# EAGLE design MainController (EAGLE 6.5.0)
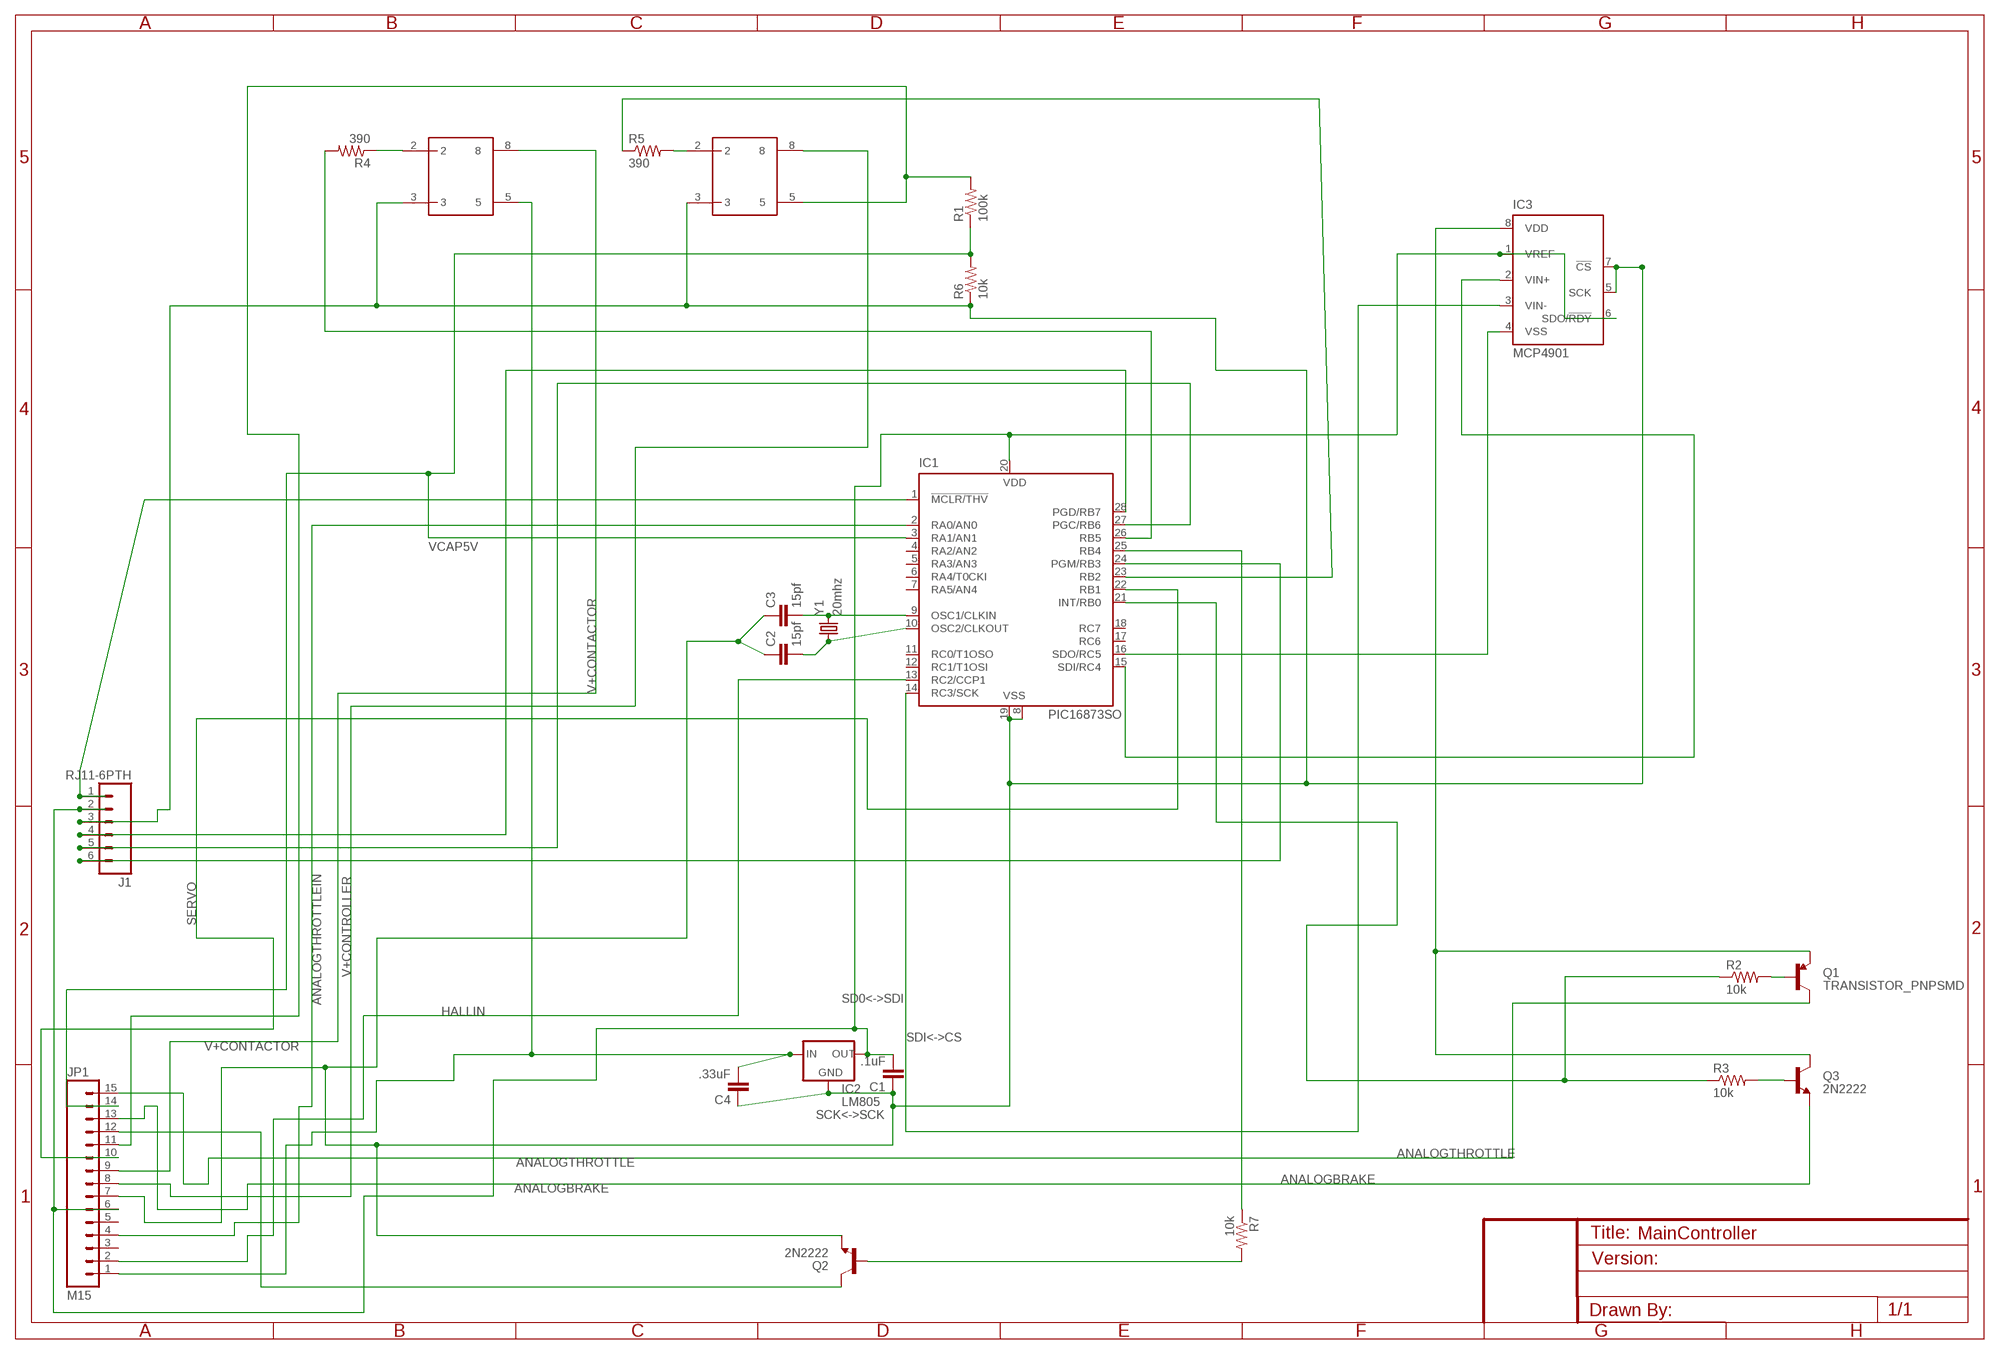
[diagram p0: schematic, sheet 1]

## Parts
C1  .1uF  CAP0402-CAP  [0402-CAP]
C2  15pf  CAP0402-CAP  [0402-CAP]
C3  15pf  CAP0402-CAP  [0402-CAP]
C4  .33uF  CAP0402-CAP  [0402-CAP]
IC1  PIC16873SO  [SO28W]
IC2  LM805  78XXL  [78XXL]
IC3  MCP4901  MCP3553SN  [SO-08]
J1  RJ11-6PTH  [RJ11-6]
JP1  M15  [1X15]
Q1  TRANSISTOR_PNPSMD  [SOT23-3]
Q2  2N2222  TRANSISTOR_NPNSOT23-3  [SOT23-3]
Q3  2N2222  TRANSISTOR_NPNSOT23  [SOT23]
R1  100k  RESISTOR0805-RES  [0805]
R2  10k  RESISTOR0805-RES  [0805]
R3  10k  RESISTOR0805-RES  [0805]
R4  390  RESISTOR0805-RES  [0805]
R5  390  RESISTOR0805-RES  [0805]
R6  10k  RESISTOR0805-RES  [0805]
R7  10k  RESISTOR0805-RES  [0805]
U$14  OPTO_DARL_6N138S  [8-SMD]
U$18  OPTO_DARL_6N138S  [8-SMD]
Y1  20mhz  CRYSTALHC49US  [HC49US]

## Nets
ANALOGBRAKE: JP1.13 Q3.2(E)
ANALOGTHROTTLE: JP1.15 Q1.3(C)
ANALOGTHROTTLEIN: IC1.2(RA0/AN0) JP1.4
GROUND: C1.1 C2.1 C3.1 C4.1 IC1.8(VSS) IC1.19(VSS) IC2.GND IC3.5(SCK) IC3.7(!CS) J1.3 JP1.7 Q2.2(E) R6.1 U$14.3 U$18.3
HALLIN: IC1.13(RC2/CCP1) JP1.2
N$1: R4.1 U$14.2
N$2: IC1.1(!MCLR/THV) J1.1
N$3: IC1.28(PGD/RB7) J1.4
N$4: IC1.27(PGC/RB6) J1.5
N$5: C3.2 IC1.9(OSC1/CLKIN) Y1.2
N$6: C2.2 IC1.10(OSC2/CLKOUT) Y1.1
N$7: IC3.8(VDD) Q1.2(E) Q3.3(C)
N$8: IC1.26(RB5) R4.2
N$9: IC1.23(RB2) R5.1
N$10: R5.2 U$18.2
N$11: Q3.1(B) R3.2
N$12: JP1.12 Q2.3(C)
N$13: Q2.1(B) R7.2
N$14: IC1.21(INT/RB0) R2.1 R3.1
N$15: IC1.25(RB4) R7.1
N$16: Q1.1(B) R2.2
N$17: IC1.24(PGM/RB3) J1.6
N$19: JP1.11 R1.2 U$18.5
N$20: C4.2 IC2.IN JP1.1 U$14.5
N$25: C1.2 IC1.20(VDD) IC2.OUT IC3.1(VREF) IC3.6(SDO/!RDY) J1.2 JP1.6
SCK<->SCK: IC1.14(RC3/SCK) IC3.3(VIN-)
SD0<->SDI: IC1.16(SDO/RC5) IC3.4(VSS)
SDI<->CS: IC1.15(SDI/RC4) IC3.2(VIN+)
SERVO: IC1.22(RB1) JP1.10
V+CONTACTOR: JP1.9 U$14.8
V+CONTROLLER: JP1.8 U$18.8
VCAP5V: IC1.3(RA1/AN1) JP1.14 R1.1 R6.2
Unconnected: IC1.4(RA2/AN2) IC1.5(RA3/AN3) IC1.6(RA4/T0CKI) IC1.7(RA5/AN4) IC1.11(RC0/T1OSO) IC1.12(RC1/T1OSI) IC1.17(RC6) IC1.18(RC7) JP1.3 JP1.5

## Library data of the parts
C1-C4 = SparkFun:CAP: Capacitor Standard 0603 ceramic capacitor, and 0.1" leaded capacitor.
IC1 = microchip:PIC16*873: MICROCONTROLLER flash type; OC_FARNELL: unknown; OC_NEWARK: unknown
IC2 = v-reg:78XXL: VOLTAGE REGULATOR
IC3 = microchip:MCP355*: Low-Power, Single-Channel 22-Bit Delta-Sigma ADCs Source: http://ww1.microchip.com/downloads/en/DeviceDoc/21950c.pdf; MF: MICROCHIP; MPN: MCP3553-E/SN; OC_FARNELL: 1605569; OC_NEWARK: 56K7004
J1 = SparkFun:RJ11-6: RJ11 Jack Simple 6 pin RJ11 jack. Commonly found on CAT3 devices and Microchip programmers. SKU: PRT-00132
JP1 = SparkFun:M15: Header 15 Standard 15-pin 0.1" header. Use with straight break away headers (SKU : PRT-00116), right angle break away headers (PRT-00553), swiss pins (PRT-00743), machine pins (PRT-00117), and female headers (PRT-00115).
Q1 = SparkFun:TRANSISTOR_PNP
Q2 Q3 = SparkFun:TRANSISTOR_NPN: Transistor NPN BJT configuration in SOT23 package. MMBT2222 is the common NPN we use. Double check BCE configuration again layout.
R1-R7 = SparkFun:RESISTOR: Resistor Basic schematic elements and footprints for 0603, 1206, and PTH resistors.
U$14 U$18 = SparkFun-DiscreteSemi-2:OPTO_DARL_6N138S: Optoisolator, darlington pair output
Y1 = SparkFun:CRYSTAL: Crystals Various standard crystals. Proven footprints. Spark Fun Electronics SKU : COM-00534

## Board
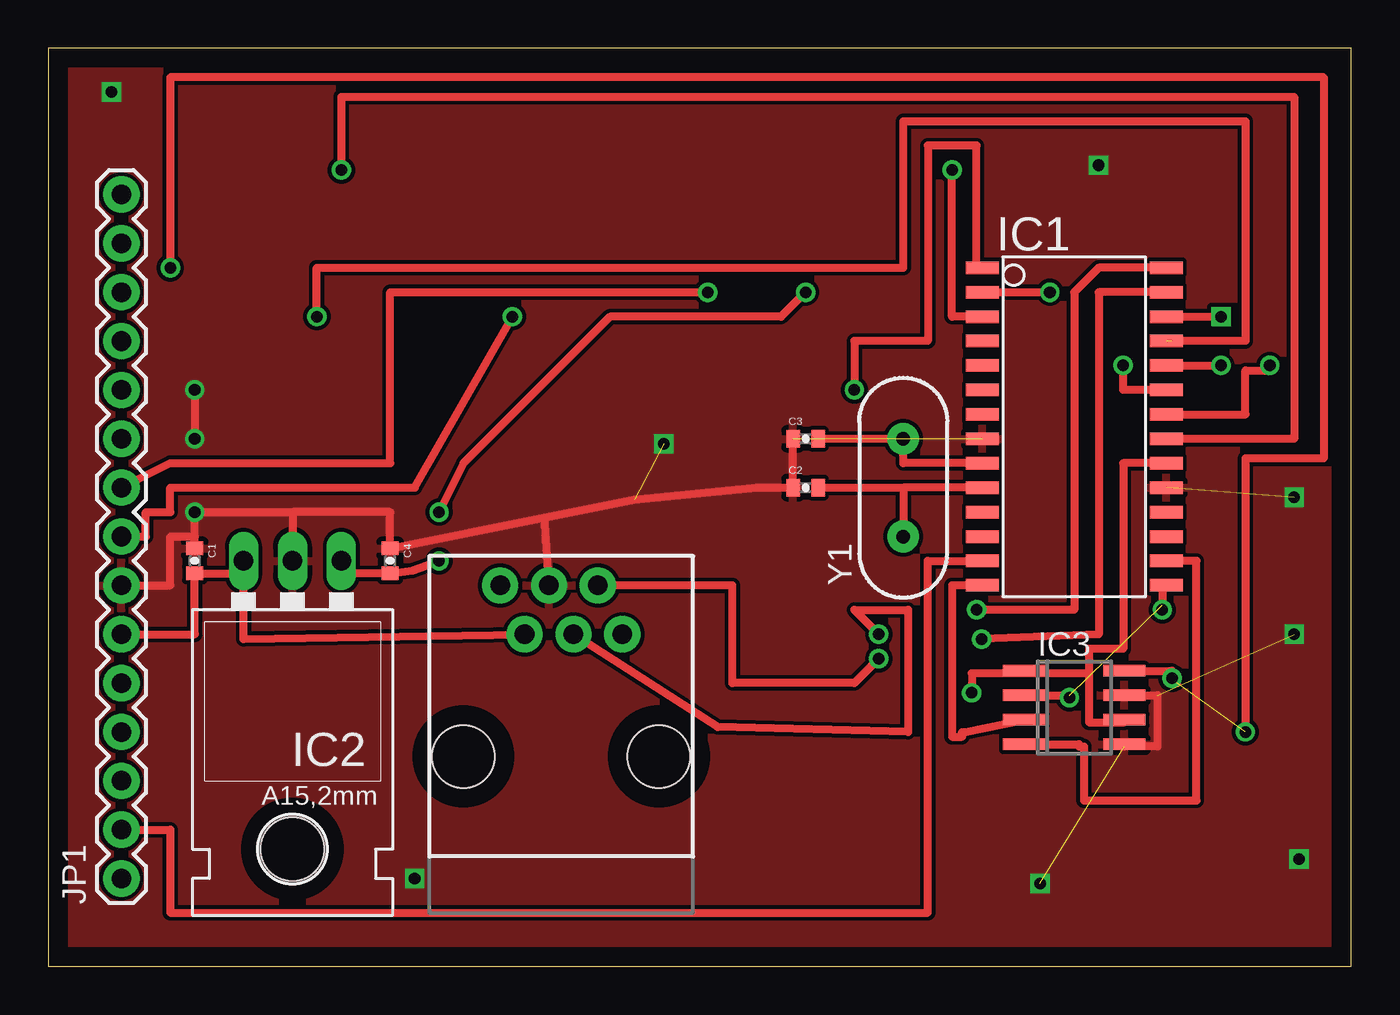
[diagram p1: board, top side]
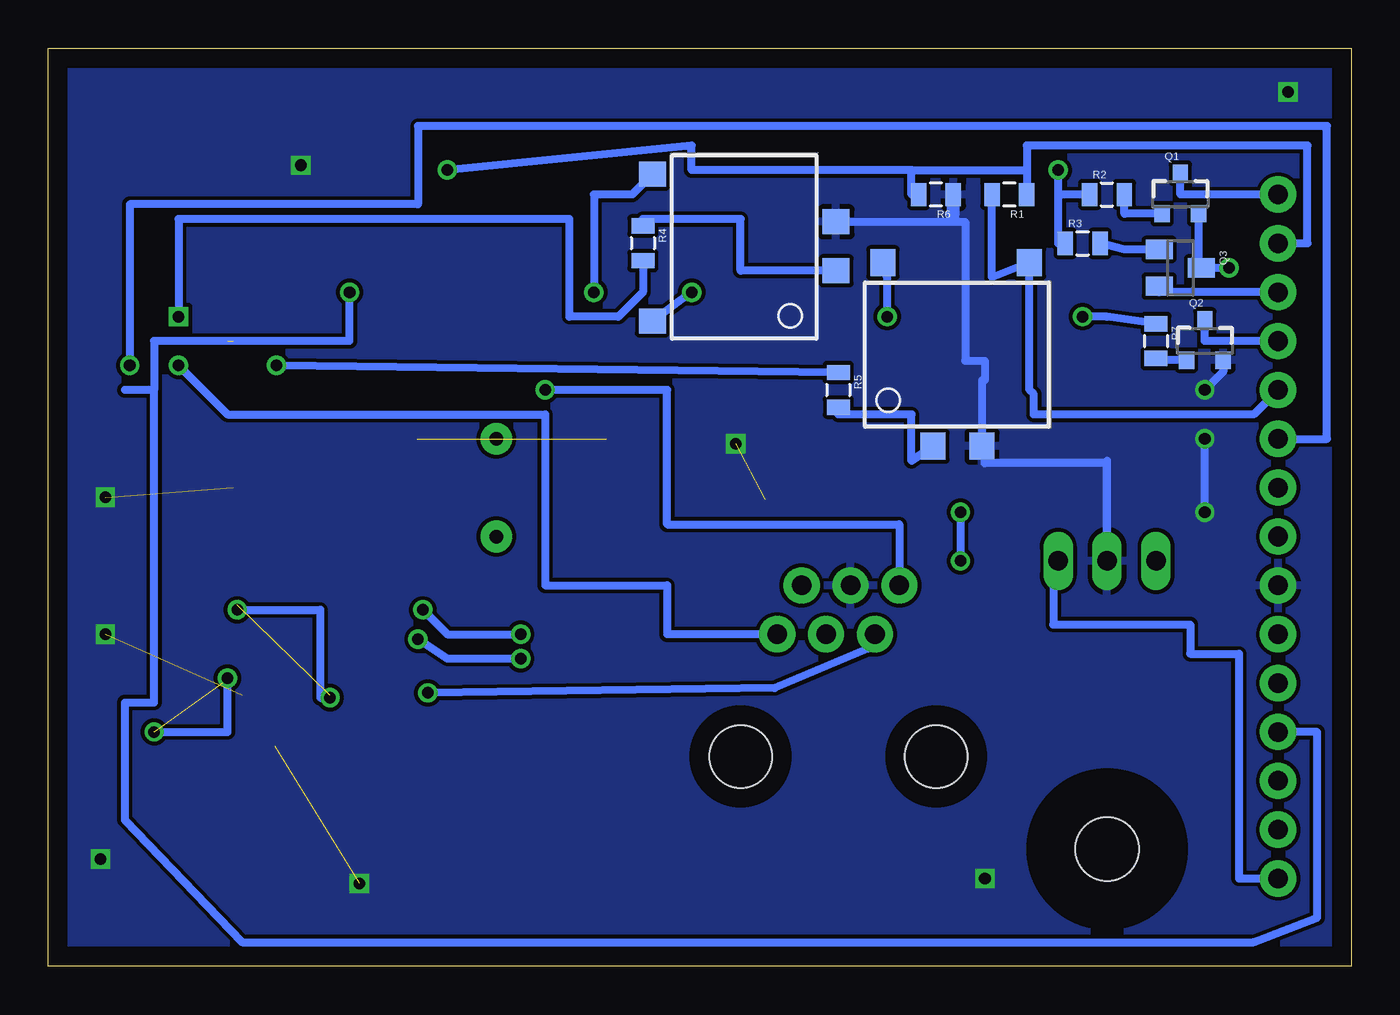
[diagram p2: board, bottom side, seen from below]

Size 67.74 x 47.74 mm. Coordinates in mm from the lower left corner, seen from the top.
Outline: 0,0 67.74,0 67.74,47.74 0,47.74 0,0
Copper layers (1*16): Top 0.035mm / dielectric 1.5mm / Bottom 0.035mm
Design rules "default": minimum track width 5mil, minimum drill 10mil, track to track 8mil, track to pad 8mil, pad to pad 8mil, via to via 8mil, smd to smd 8mil, copper to edge 40mil, drill to drill 8mil, minimum pad ring 10mil, minimum via ring 8mil, stop-mask expansion 4mil, vias tented up to drill 0mil, thermal gap 10mil

### Footprints (pad centres in the part's own frame; a part is rotated, then mirrored left to right if it is on the bottom)
0402-CAP = smd 0.7 x 0.9: 1 -0.65,0; 2 0.65,0
SO28W = smd 0.65 x 1.7: 1 -7.62,-4.78; 2 -6.35,-4.78; 3 -5.08,-4.78; 4 -3.81,-4.78; 5 -2.54,-4.78; 6 -1.27,-4.78; 7 0,-4.78; 8 1.27,-4.78; 9 2.54,-4.78; 10 3.81,-4.78; 11 5.08,-4.78; 12 6.35,-4.78; 13 7.62,-4.78; 14 8.89,-4.78; 15 8.89,4.78; 16 7.62,4.78; 17 6.35,4.78; 18 5.08,4.78; 19 3.81,4.78; 20 2.54,4.78; 21 1.27,4.78; 22 0,4.78; 23 -1.27,4.78; 24 -2.54,4.78; 25 -3.81,4.78; 26 -5.08,4.78; 27 -6.35,4.78; 28 -7.62,4.78
78XXL = drill 1.016 long: GND 0,-3.81; IN -2.54,-3.81; OUT 2.54,-3.81 | hole 3.302: 0,11.176
SO-08 = smd 0.6 x 2.2: 1 -1.905,-2.6; 2 -0.635,-2.6; 3 0.635,-2.6; 4 1.905,-2.6; 5 1.905,2.6; 6 0.635,2.6; 7 -0.635,2.6; 8 -1.905,2.6
RJ11-6 = drill 1.016 pad 1.88: 1 1.905,8.89; 2 3.175,6.35; 3 4.445,8.89; 4 5.715,6.35; 5 6.985,8.89; 6 8.255,6.35 | hole 3.251: 0,0; 10.16,0
1X15 = drill 1.016 pad 1.88: 1 0,0; 2 2.54,0; 3 5.08,0; 4 7.62,0; 5 10.16,0; 6 12.7,0; 7 15.24,0; 8 17.78,0; 9 20.32,0; 10 22.86,0; 11 25.4,0; 12 27.94,0; 13 30.48,0; 14 33.02,0; 15 35.56,0
SOT23-3 = smd 0.8 x 0.9: 1 -0.95,-1; 2 0.95,-1; 3 0,1.1
SOT23 = smd 1 x 1.4: 1 -0.95,-1.1; 2 0.95,-1.1; 3 0,1.1
0805 = smd 0.8 x 1.2: 1 -0.9,0; 2 0.9,0
8-SMD = smd 1.3 x 1.4: 2 -1.42,-4.96; 3 1.12,-4.96; 5 3.59,4.58; 8 -4.03,4.58
HC49US = drill 0.7 pad 1.651: 1 -2.54,0; 2 2.54,0

### Placement (x,y rotation side)
C1  7.62,21.08 270 top
C2  39.37,24.89 0 top
C3  39.37,27.43 0 top
C4  17.78,21.08 270 top
IC1  53.34,28.7 270 top
IC2  12.7,17.27 180 top
IC3  53.34,13.46 270 top
J1  21.59,10.92 0 top
JP1  3.81,4.57 90 top
Q1  8.89,40.13 0 bottom
Q2  7.62,32.51 0 bottom
Q3  8.89,36.32 270 bottom
R1  17.78,40.13 180 bottom
R2  12.7,40.13 0 bottom
R3  13.97,37.59 0 bottom
R4  36.83,37.59 270 bottom
R5  26.67,29.97 270 bottom
R6  21.59,40.13 180 bottom
R7  10.16,32.51 270 bottom
U$14  31.75,37.59 90 bottom
U$18  20.32,32 0 bottom
Y1  44.45,24.89 90 top

### Tracks (layer width: path | path; a pad name or v marks a point on that pad's centre or on a via)
ANALOGBRAKE
  Bottom 0.406: JP1.13 9.99,35.05 Q3.2
ANALOGTHROTTLE
  Bottom 0.406: JP1.15 8.89,40.13 Q1.3
ANALOGTHROTTLEIN  (via drill 0.6)
  Top 0.406: IC1.2 v52.07,35.05
  Bottom 0.406: v52.07,35.05 52.07,32.51 62.23,32.51 62.23,29.97 | 62.23,29.97 63.75,29.97 | 62.23,29.97 62.23,13.72 63.75,13.72 63.75,7.62 57.66,1.27 5.08,1.27 1.78,2.54 1.78,12.19 JP1.4
GROUND  (via drill 0.6)  (5 unrouted)
  Top 0.406: C3.1 C2.1 36.83,24.89 30.48,24.27 25.81,23.34 | JP1.7 6.35,19.81 6.35,22.35 7.62,22.35 | C1.1 7.62,22.35 | 7.62,22.35 v7.62,23.62 12.7,23.62 | 12.7,23.62 IC2.GND | 12.7,23.62 17.78,23.62 C4.1 25.81,23.34 | v7.62,29.97 v7.62,27.43 | IC3.7 57.66,14.1 57.66,11.43 55.94,11.43 IC3.5 | J1.3 25.81,23.34
  Bottom 0.406: Q2.2 6.67,30.92 v7.62,29.97 | v7.62,23.62 v7.62,27.43 | 12.7,26.28 IC2.GND 12.7,26.16 19.05,26.16 19.05,26.28 U$18.3 19.2,30.48 19.05,30.48 19.05,31.5 20.07,31.5 20.07,38.71 20.57,38.71 | U$14.3 20.57,38.71 | 20.57,38.71 20.57,39.12 | 20.57,39.12 20.83,39.12 20.83,39.88 | R6.1 20.57,40.13 20.57,39.12
  other vias: 3.3,45.47 19.05,4.57 51.56,4.32 65.02,5.59 64.77,17.27 64.77,24.38 54.61,41.66 32,27.18
  pour Bottom: 0,47.75 0,0 67.82,0 67.82,47.75
  pour Top: 0,47.75 0,0 67.82,0 67.82,47.75
HALLIN
  Top 0.406: JP1.2 6.35,7.11 6.35,2.79 45.72,2.79 45.72,21.08 IC1.13
N$1
  Bottom 0.406: U$14.2 31.75,36.17 31.75,38.86 36.83,38.86 R4.1
N$2  (via drill 0.6)
  Top 0.406: IC1.1 48.26,36.32 48.26,42.67 45.72,42.67 45.72,32.51 41.91,32.51 v41.91,29.97
  Bottom 0.406: v41.91,29.97 35.56,29.97 35.56,22.99 23.5,22.99 J1.1
N$3  (via drill 0.6)
  Top 0.406: IC1.28 54.61,36.32 53.34,35.05 53.34,18.54 v48.26,18.54 | v43.18,17.27 41.91,18.54 44.7,18.54 44.7,12.19 34.8,12.45 J1.4
  Bottom 0.406: v48.26,18.54 46.99,17.27 v43.18,17.27
N$4  (via drill 0.6)
  Top 0.406: IC1.27 54.61,35.05 54.61,17.27 v48.51,17.02 | v43.18,16 41.91,14.73 35.56,14.73 35.56,19.81 J1.5
  Bottom 0.406: v48.51,17.02 46.99,16 v43.18,16
N$5
  Top 0.406: IC1.9 44.45,26.16 Y1.2 C3.2
N$6
  Top 0.406: C2.2 44.45,24.89 | 44.45,24.89 Y1.1 | IC1.10 44.45,24.89
N$7  (via drill 0.6)  (1 unrouted)
  Top 0.406: v6.35,36.32 6.35,46.23 66.29,46.23 66.29,26.42 62.23,26.42 v62.23,12.19 | IC3.8 58.42,15.37 58.42,14.99 58.67,14.99 58.67,14.73
  Bottom 0.406: Q1.2 7.94,36.32 Q3.3 v6.35,36.32
N$8  (via drill 0.6)
  Top 0.406: IC1.26 v60.96,33.78
  Bottom 0.406: v60.96,33.78 60.96,38.86 40.64,38.86 40.64,37.59 40.64,33.78 38.1,33.78 36.83,35.05 R4.2
N$9  (via drill 0.6)
  Top 0.406: IC1.23 55.88,29.97 v55.88,31.24
  Bottom 0.406: R5.1 v55.88,31.24
N$10
  Bottom 0.406: U$18.2 22.86,26.28 22.86,28.7 26.67,28.7 R5.2
N$11
  Bottom 0.406: Q3.1 11.8,37.27 R3.2
N$12
  Bottom 0.406: JP1.12 7.62,32.51 Q2.3
N$13
  Bottom 0.406: Q2.1 10.16,31.51 R7.2
N$14  (via drill 0.6)
  Top 0.406: v15.24,41.4 15.24,45.21 64.77,45.21 64.77,27.43 IC1.21
  Bottom 0.406: R3.1 15.24,37.59 15.24,40.13 | R2.1 15.24,40.13 | 15.24,40.13 v15.24,41.4
N$15  (via drill 0.6)  (1 unrouted)
  Top 0.406: v13.97,33.78 13.97,36.32 44.45,36.32 44.45,43.94 62.23,43.94 62.23,32.51 58.42,32.51
  Bottom 0.406: R7.1 12.7,33.78 v13.97,33.78
N$16
  Bottom 0.406: Q1.1 11.8,39.13 R2.2
N$17  (via drill 0.6)
  Top 0.406: IC1.24 v60.96,31.24
  Bottom 0.406: v60.96,31.24 58.42,28.7 41.91,28.7 41.91,19.81 35.56,19.81 35.56,17.27 J1.6
N$19
  Bottom 0.406: R1.2 18.68,35.82 U$18.5 16.73,29.97 16.51,29.75 16.51,28.7 5.08,28.7 JP1.11
N$20  (via drill 0.6)
  Top 0.406: IC2.IN 15.24,20.43 C4.2 18.94,20.57 v20.32,21.08 | v39.37,35.05 38.1,33.78 29.21,33.78 21.59,26.16 v20.32,23.62
  Bottom 0.406: U$14.5 37.38,40.13 39.37,40.13 v39.37,35.05 | v20.32,23.62 v20.32,21.08 | IC2.IN 15.49,21.08 15.49,17.78 8.38,17.78 8.38,16.26 5.84,16.26 5.84,4.57 JP1.1
N$23  (via drill 0.6)
  other vias: 57.91,18.54
N$25  (via drill 0.6)
  Top 0.406: JP1.6 7.62,17.27 C1.2 10.16,20.43 | 10.16,20.43 IC2.OUT | 10.16,20.43 10.16,17.02 J1.2 | IC1.20 55.88,26.16 55.88,16.51 54.1,16.51 54.1,15.24 | 54.1,15.24 54.1,12.7 55.94,12.7 IC3.6 | 54.1,15.24 50.74,15.24 | 50.74,15.24 IC3.1 | 50.74,15.24 48.01,15.24 v48.01,14.22
  Bottom 0.406: J1.2 25.15,17.27 25.15,16.51 29.97,14.48 v48.01,14.22
N$27  (via drill 0.6)
  Bottom 0.406: 57.91,18.54 53.59,18.54 53.59,13.97 v53.09,13.97
N$28  (via drill 0.6)
  Bottom 0.406: 61.98,12.19 58.42,12.19 v58.42,14.99
SCK<->SCK
  Top 0.406: IC1.14 46.99,19.81 46.99,11.94 47.5,11.94 47.5,12.19 47.69,12.19 IC3.3
SD0<->SDI
  Top 0.406: IC1.16 59.69,21.08 59.69,8.64 53.85,8.64 53.85,11.43 53.59,11.43 53.59,11.56 IC3.4
SDI<->CS  (1 unrouted)
  Top 0.406: IC1.15 57.91,19.81 57.91,18.8 | IC3.2 53.09,14.1 53.09,13.97
SERVO  (via drill 0.6)
  Top 0.406: IC1.22 62.23,28.7 62.23,30.99 63.5,30.99 v63.5,31.24
  Bottom 0.406: JP1.10 1.27,27.43 1.27,43.69 48.51,43.69 48.51,39.62 63.5,39.62 v63.5,31.24
V+CONTACTOR  (via drill 0.6)
  Top 0.406: JP1.9 6.35,26.16 17.78,26.16 17.78,35.05 v34.29,35.05
  Bottom 0.406: U$14.8 v34.29,35.05
V+CONTROLLER  (via drill 0.6)
  Top 0.406: JP1.8 5.08,22.35 5.08,23.62 6.35,23.62 6.35,24.89 19.05,24.89 v24.13,33.78
  Bottom 0.406: U$18.8 24.13,35.82 v24.13,33.78
VCAP5V  (via drill 0.6)
  Top 0.406: IC1.3 46.99,33.78 v46.99,41.4
  Bottom 0.406: JP1.14 2.29,37.59 2.29,42.67 16.88,42.67 16.88,41.4 | 16.88,41.4 R1.1 | R6.2 22.86,40.13 22.86,41.4 | 22.86,41.4 16.88,41.4 | 22.86,41.4 34.29,41.4 34.29,42.67 v46.99,41.4